# EAGLE schematic 75 (EAGLE 9.6.1)
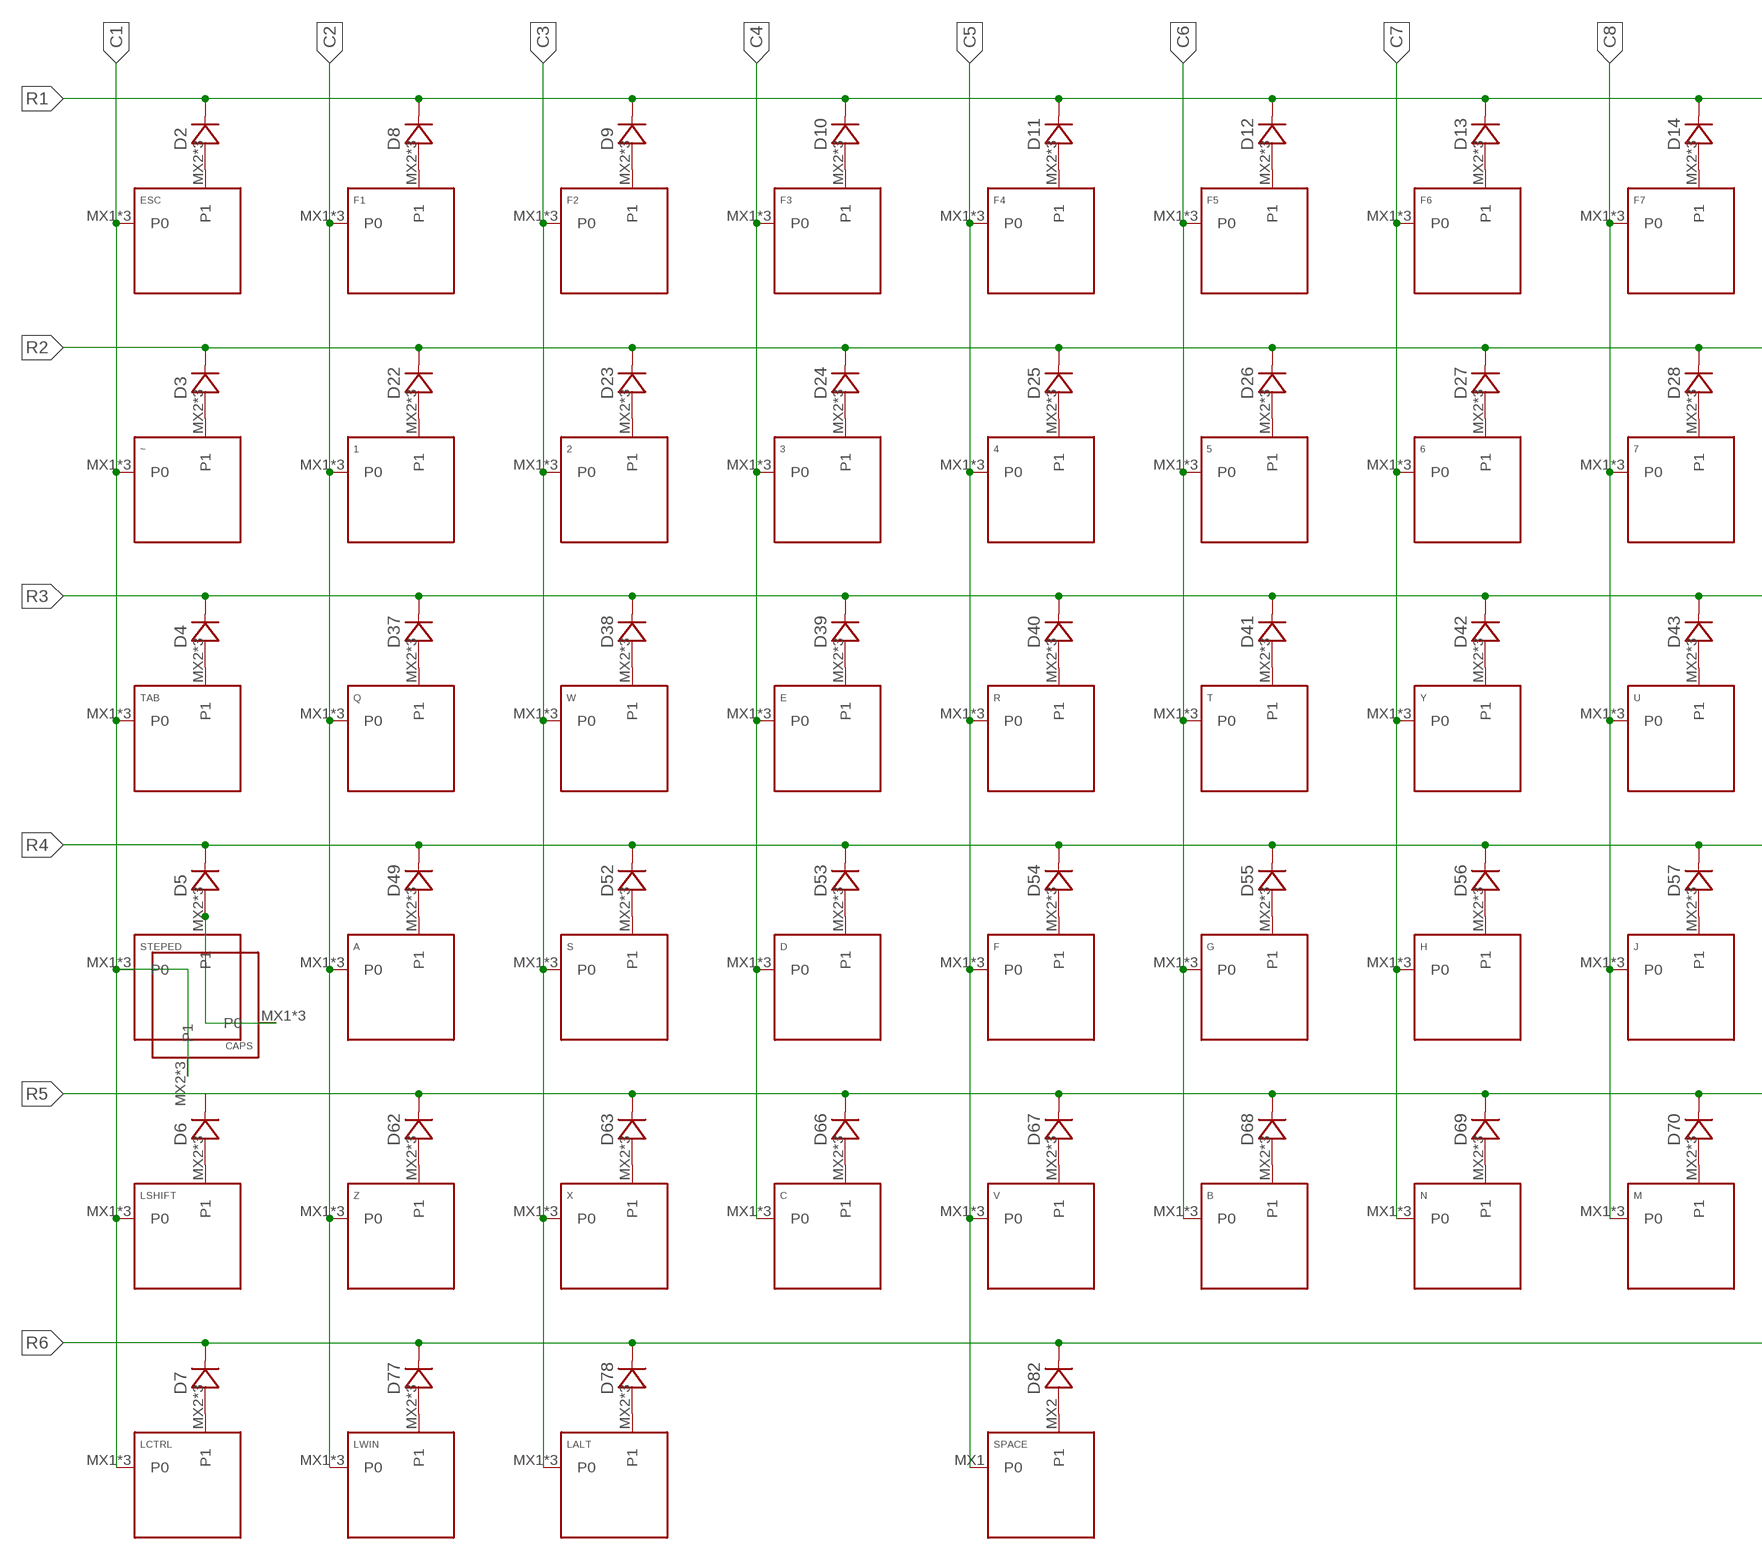
[diagram p0: schematic, sheet 1, part 1 of 2]
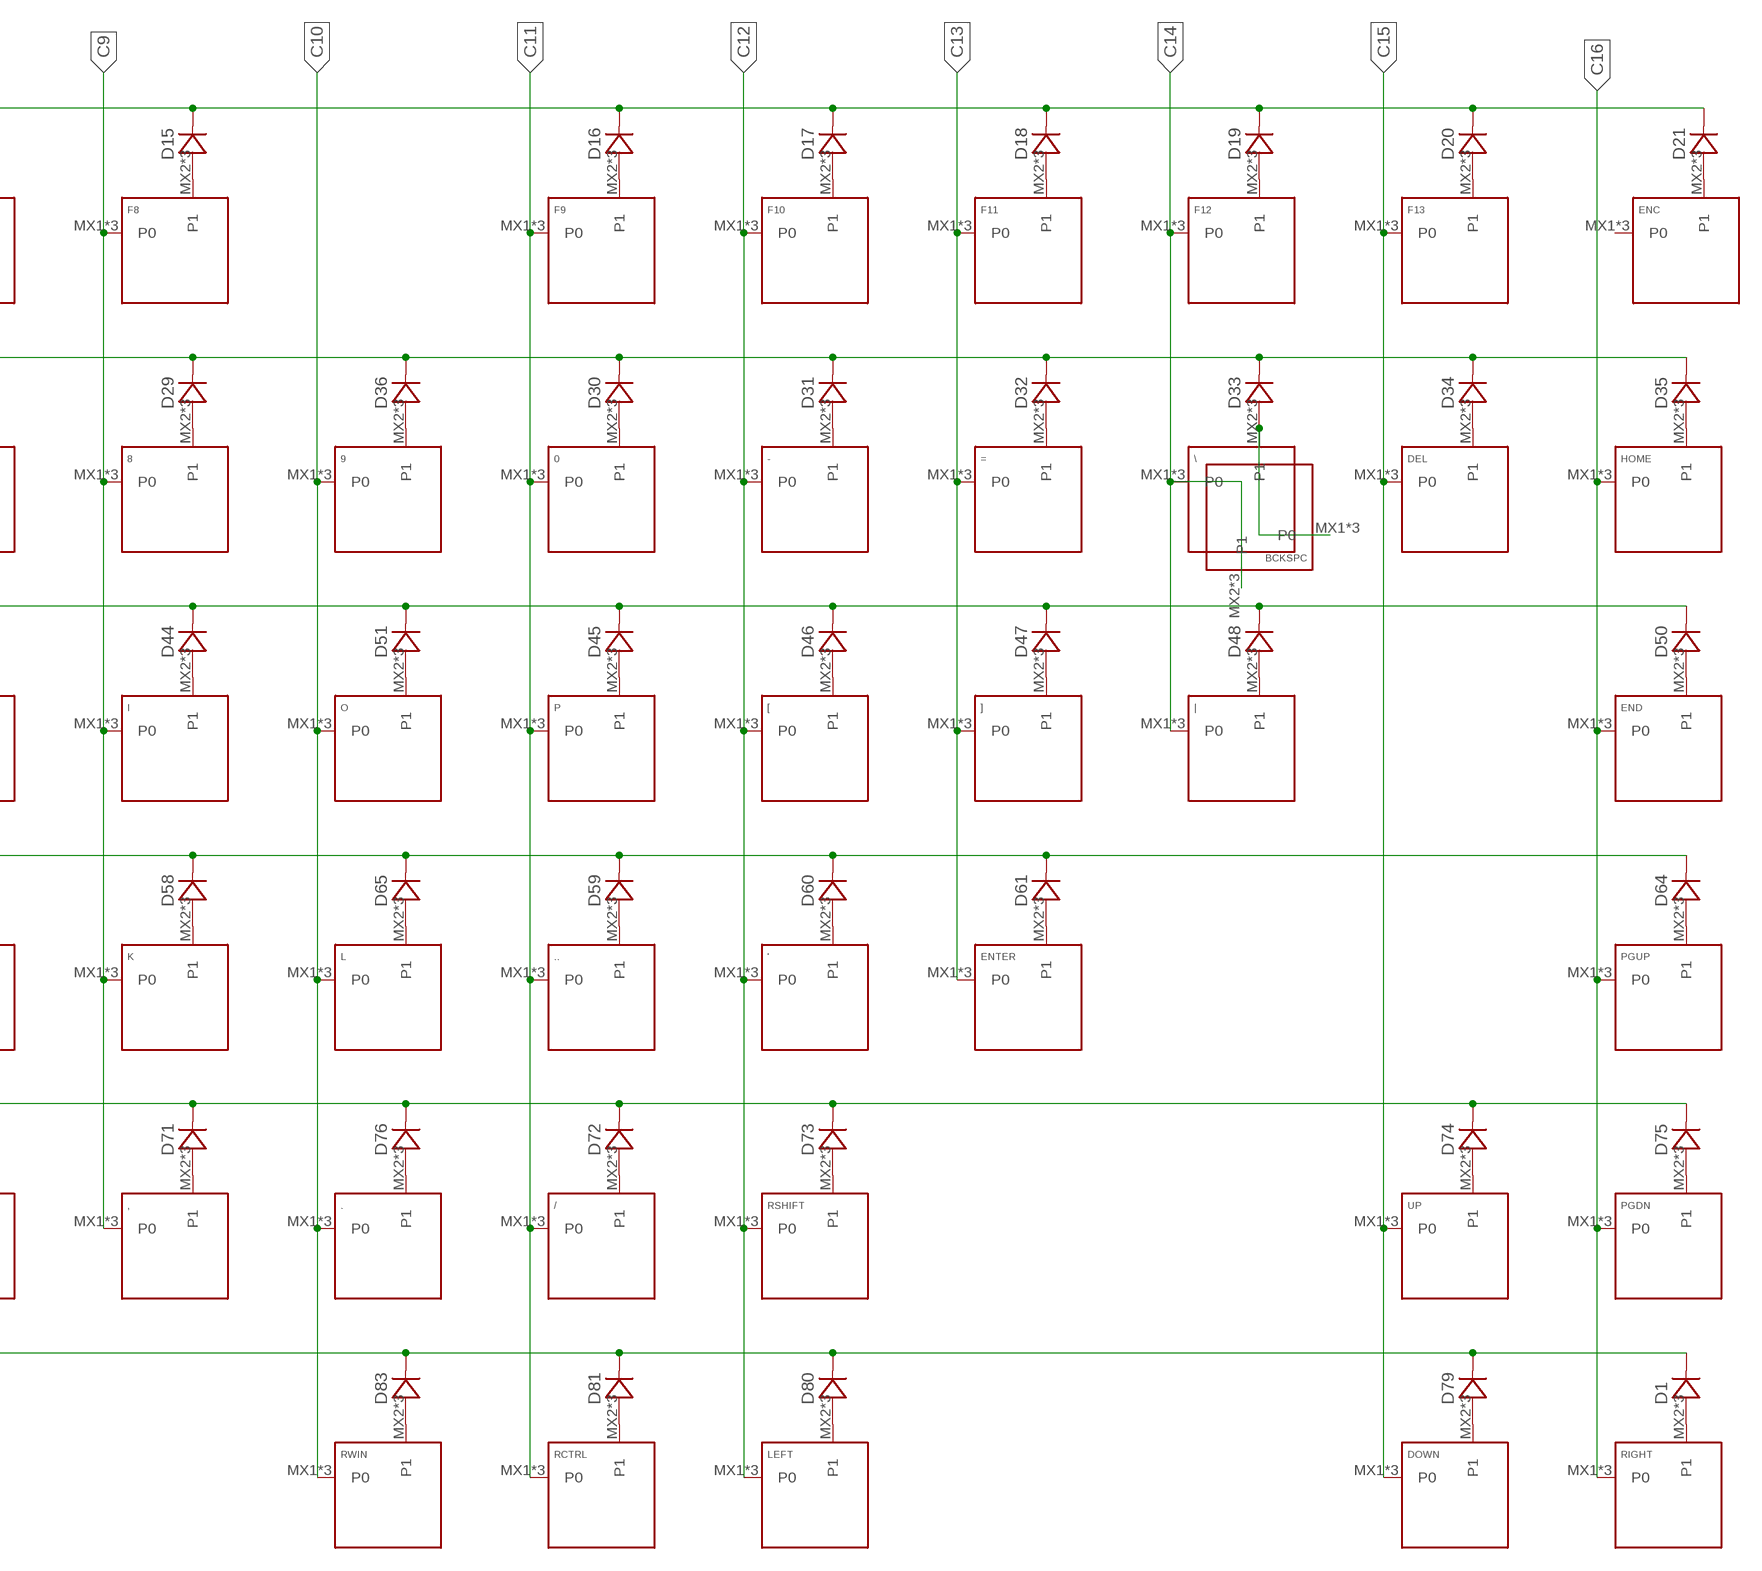
[diagram p1: schematic, sheet 1, part 2 of 2]

## Parts
0  KEYSWITCH-PLAIN-MXHSPCB-1U  [MXHSPCB-1U]
1  KEYSWITCH-PLAIN-MXHSPCB-1U  [MXHSPCB-1U]
2  KEYSWITCH-PLAIN-MXHSPCB-1U  [MXHSPCB-1U]
3  KEYSWITCH-PLAIN-MXHSPCB-1U  [MXHSPCB-1U]
4  KEYSWITCH-PLAIN-MXHSPCB-1U  [MXHSPCB-1U]
5  KEYSWITCH-PLAIN-MXHSPCB-1U  [MXHSPCB-1U]
6  KEYSWITCH-PLAIN-MXHSPCB-1U  [MXHSPCB-1U]
7  KEYSWITCH-PLAIN-MXHSPCB-1U  [MXHSPCB-1U]
8  KEYSWITCH-PLAIN-MXHSPCB-1U  [MXHSPCB-1U]
9  KEYSWITCH-PLAIN-MXHSPCB-1U  [MXHSPCB-1U]
'  KEYSWITCH-PLAIN-MXHSPCB-1U  [MXHSPCB-1U]
,  KEYSWITCH-PLAIN-MXHSPCB-1U  [MXHSPCB-1U]
-  KEYSWITCH-PLAIN-MXHSPCB-1U  [MXHSPCB-1U]
.  KEYSWITCH-PLAIN-MXHSPCB-1U  [MXHSPCB-1U]
..  KEYSWITCH-PLAIN-MXHSPCB-1U  [MXHSPCB-1U]
/  KEYSWITCH-PLAIN-MXHSPCB-1U  [MXHSPCB-1U]
=  KEYSWITCH-PLAIN-MXHSPCB-1U  [MXHSPCB-1U]
[  KEYSWITCH-PLAIN-MXHSPCB-1U  [MXHSPCB-1U]
\\  KEYSWITCH-PLAIN-MXHSPCB-1U  [MXHSPCB-1U]
]  KEYSWITCH-PLAIN-MXHSPCB-1U  [MXHSPCB-1U]
A  KEYSWITCH-PLAIN-MXHSPCB-1U  [MXHSPCB-1U]
B  KEYSWITCH-PLAIN-MXHSPCB-1U  [MXHSPCB-1U]
BCKSPC  KEYSWITCH-PLAIN-MXHSPCB-2U  [MXHSPCB-2U]
C  KEYSWITCH-PLAIN-MXHSPCB-1U  [MXHSPCB-1U]
CAPS  KEYSWITCH-PLAIN-MXHSPCB-1U  [MXHSPCB-1U]
D  KEYSWITCH-PLAIN-MXHSPCB-1U  [MXHSPCB-1U]
D1  DIODE-SOD-123  [SOD-123]
D2  DIODE-SOD-123  [SOD-123]
D3  DIODE-SOD-123  [SOD-123]
D4  DIODE-SOD-123  [SOD-123]
D5  DIODE-SOD-123  [SOD-123]
D6  DIODE-SOD-123  [SOD-123]
D7  DIODE-SOD-123  [SOD-123]
D8  DIODE-SOD-123  [SOD-123]
D9  DIODE-SOD-123  [SOD-123]
D10  DIODE-SOD-123  [SOD-123]
D11  DIODE-SOD-123  [SOD-123]
D12  DIODE-SOD-123  [SOD-123]
D13  DIODE-SOD-123  [SOD-123]
D14  DIODE-SOD-123  [SOD-123]
D15  DIODE-SOD-123  [SOD-123]
D16  DIODE-SOD-123  [SOD-123]
D17  DIODE-SOD-123  [SOD-123]
D18  DIODE-SOD-123  [SOD-123]
D19  DIODE-SOD-123  [SOD-123]
D20  DIODE-SOD-123  [SOD-123]
D21  DIODE-SOD-123  [SOD-123]
D22  DIODE-SOD-123  [SOD-123]
D23  DIODE-SOD-123  [SOD-123]
D24  DIODE-SOD-123  [SOD-123]
D25  DIODE-SOD-123  [SOD-123]
D26  DIODE-SOD-123  [SOD-123]
D27  DIODE-SOD-123  [SOD-123]
D28  DIODE-SOD-123  [SOD-123]
D29  DIODE-SOD-123  [SOD-123]
D30  DIODE-SOD-123  [SOD-123]
D31  DIODE-SOD-123  [SOD-123]
D32  DIODE-SOD-123  [SOD-123]
D33  DIODE-SOD-123  [SOD-123]
D34  DIODE-SOD-123  [SOD-123]
D35  DIODE-SOD-123  [SOD-123]
D36  DIODE-SOD-123  [SOD-123]
D37  DIODE-SOD-123  [SOD-123]
D38  DIODE-SOD-123  [SOD-123]
D39  DIODE-SOD-123  [SOD-123]
D40  DIODE-SOD-123  [SOD-123]
D41  DIODE-SOD-123  [SOD-123]
D42  DIODE-SOD-123  [SOD-123]
D43  DIODE-SOD-123  [SOD-123]
D44  DIODE-SOD-123  [SOD-123]
D45  DIODE-SOD-123  [SOD-123]
D46  DIODE-SOD-123  [SOD-123]
D47  DIODE-SOD-123  [SOD-123]
D48  DIODE-SOD-123  [SOD-123]
D49  DIODE-SOD-123  [SOD-123]
D50  DIODE-SOD-123  [SOD-123]
D51  DIODE-SOD-123  [SOD-123]
D52  DIODE-SOD-123  [SOD-123]
D53  DIODE-SOD-123  [SOD-123]
D54  DIODE-SOD-123  [SOD-123]
D55  DIODE-SOD-123  [SOD-123]
D56  DIODE-SOD-123  [SOD-123]
D57  DIODE-SOD-123  [SOD-123]
D58  DIODE-SOD-123  [SOD-123]
D59  DIODE-SOD-123  [SOD-123]
D60  DIODE-SOD-123  [SOD-123]
D61  DIODE-SOD-123  [SOD-123]
D62  DIODE-SOD-123  [SOD-123]
D63  DIODE-SOD-123  [SOD-123]
D64  DIODE-SOD-123  [SOD-123]
D65  DIODE-SOD-123  [SOD-123]
D66  DIODE-SOD-123  [SOD-123]
D67  DIODE-SOD-123  [SOD-123]
D68  DIODE-SOD-123  [SOD-123]
D69  DIODE-SOD-123  [SOD-123]
D70  DIODE-SOD-123  [SOD-123]
D71  DIODE-SOD-123  [SOD-123]
D72  DIODE-SOD-123  [SOD-123]
D73  DIODE-SOD-123  [SOD-123]
D74  DIODE-SOD-123  [SOD-123]
D75  DIODE-SOD-123  [SOD-123]
D76  DIODE-SOD-123  [SOD-123]
D77  DIODE-SOD-123  [SOD-123]
D78  DIODE-SOD-123  [SOD-123]
D79  DIODE-SOD-123  [SOD-123]
D80  DIODE-SOD-123  [SOD-123]
D81  DIODE-SOD-123  [SOD-123]
D82  DIODE-SOD-123  [SOD-123]
D83  DIODE-SOD-123  [SOD-123]
DEL  KEYSWITCH-PLAIN-MXHSPCB-1U  [MXHSPCB-1U]
DOWN  KEYSWITCH-PLAIN-MXHSPCB-1U  [MXHSPCB-1U]
E  KEYSWITCH-PLAIN-MXHSPCB-1U  [MXHSPCB-1U]
ENC  KEYSWITCH-PLAIN-MXHSPCB-1U  [MXHSPCB-1U]
END  KEYSWITCH-PLAIN-MXHSPCB-1U  [MXHSPCB-1U]
ENTER  KEYSWITCH-PLAIN-MXHSPCB-2U-FLIPPED  [MXHSPCB-2U-FLIPPED]
ESC  KEYSWITCH-PLAIN-MXHSPCB-1U  [MXHSPCB-1U]
F  KEYSWITCH-PLAIN-MXHSPCB-1U  [MXHSPCB-1U]
F1  KEYSWITCH-PLAIN-MXHSPCB-1U  [MXHSPCB-1U]
F2  KEYSWITCH-PLAIN-MXHSPCB-1U  [MXHSPCB-1U]
F3  KEYSWITCH-PLAIN-MXHSPCB-1U  [MXHSPCB-1U]
F4  KEYSWITCH-PLAIN-MXHSPCB-1U  [MXHSPCB-1U]
F5  KEYSWITCH-PLAIN-MXHSPCB-1U  [MXHSPCB-1U]
F6  KEYSWITCH-PLAIN-MXHSPCB-1U  [MXHSPCB-1U]
F7  KEYSWITCH-PLAIN-MXHSPCB-1U  [MXHSPCB-1U]
F8  KEYSWITCH-PLAIN-MXHSPCB-1U  [MXHSPCB-1U]
F9  KEYSWITCH-PLAIN-MXHSPCB-1U  [MXHSPCB-1U]
F10  KEYSWITCH-PLAIN-MXHSPCB-1U  [MXHSPCB-1U]
F11  KEYSWITCH-PLAIN-MXHSPCB-1U  [MXHSPCB-1U]
F12  KEYSWITCH-PLAIN-MXHSPCB-1U  [MXHSPCB-1U]
F13  KEYSWITCH-PLAIN-MXHSPCB-1U  [MXHSPCB-1U]
G  KEYSWITCH-PLAIN-MXHSPCB-1U  [MXHSPCB-1U]
H  KEYSWITCH-PLAIN-MXHSPCB-1U  [MXHSPCB-1U]
HOME  KEYSWITCH-PLAIN-MXHSPCB-1U  [MXHSPCB-1U]
I  KEYSWITCH-PLAIN-MXHSPCB-1U  [MXHSPCB-1U]
J  KEYSWITCH-PLAIN-MXHSPCB-1U  [MXHSPCB-1U]
K  KEYSWITCH-PLAIN-MXHSPCB-1U  [MXHSPCB-1U]
L  KEYSWITCH-PLAIN-MXHSPCB-1U  [MXHSPCB-1U]
LALT  KEYSWITCH-PLAIN-MXHSPCB-1U  [MXHSPCB-1U]
LCTRL  KEYSWITCH-PLAIN-MXHSPCB-1U  [MXHSPCB-1U]
LEFT  KEYSWITCH-PLAIN-MXHSPCB-1U  [MXHSPCB-1U]
LSHIFT  KEYSWITCH-PLAIN-MXHS-2U  [MXHS-2U]
LWIN  KEYSWITCH-PLAIN-MXHSPCB-1U  [MXHSPCB-1U]
M  KEYSWITCH-PLAIN-MXHSPCB-1U  [MXHSPCB-1U]
N  KEYSWITCH-PLAIN-MXHSPCB-1U  [MXHSPCB-1U]
O  KEYSWITCH-PLAIN-MXHSPCB-1U  [MXHSPCB-1U]
P  KEYSWITCH-PLAIN-MXHSPCB-1U  [MXHSPCB-1U]
PGDN  KEYSWITCH-PLAIN-MXHSPCB-1U  [MXHSPCB-1U]
PGUP  KEYSWITCH-PLAIN-MXHSPCB-1U  [MXHSPCB-1U]
Q  KEYSWITCH-PLAIN-MXHSPCB-1U  [MXHSPCB-1U]
R  KEYSWITCH-PLAIN-MXHSPCB-1U  [MXHSPCB-1U]
RCTRL  KEYSWITCH-PLAIN-MXHSPCB-1U  [MXHSPCB-1U]
RIGHT  KEYSWITCH-PLAIN-MXHSPCB-1U  [MXHSPCB-1U]
RSHIFT  KEYSWITCH-PLAIN-MXHSPCB-1U  [MXHSPCB-1U]
RWIN  KEYSWITCH-PLAIN-MXHSPCB-1U  [MXHSPCB-1U]
S  KEYSWITCH-PLAIN-MXHSPCB-1U  [MXHSPCB-1U]
SPACE  KEYSWITCH-PLAIN-MXHSPCB-6.25U-FLIPPED  [MXHSPCB-6.25U-FLIPPED]
STEPED  KEYSWITCH-PLAIN-MXHSPCB-1U  [MXHSPCB-1U]
T  KEYSWITCH-PLAIN-MXHSPCB-1U  [MXHSPCB-1U]
TAB  KEYSWITCH-PLAIN-MXHSPCB-1U  [MXHSPCB-1U]
U  KEYSWITCH-PLAIN-MXHSPCB-1U  [MXHSPCB-1U]
UP  KEYSWITCH-PLAIN-MXHSPCB-1U  [MXHSPCB-1U]
V  KEYSWITCH-PLAIN-MXHSPCB-1U  [MXHSPCB-1U]
W  KEYSWITCH-PLAIN-MXHSPCB-1U  [MXHSPCB-1U]
X  KEYSWITCH-PLAIN-MXHSPCB-1U  [MXHSPCB-1U]
Y  KEYSWITCH-PLAIN-MXHSPCB-1U  [MXHSPCB-1U]
Z  KEYSWITCH-PLAIN-MXHSPCB-1U  [MXHSPCB-1U]
|  KEYSWITCH-PLAIN-MXHSPCB-1U  [MXHSPCB-1U]
~  KEYSWITCH-PLAIN-MXHSPCB-1U  [MXHSPCB-1U]

## Nets
C1: CAPS.MX2(P1) CAPS.P$3(P1) CAPS.P$4(P1) ESC.MX1(P0) ESC.P$1(P0) ESC.P$2(P0) LCTRL.MX1(P0) LCTRL.P$1(P0) LCTRL.P$2(P0) LSHIFT.MX1(P0) LSHIFT.P$3(P0) LSHIFT.P$4(P0) STEPED.MX1(P0) STEPED.P$1(P0) STEPED.P$2(P0) TAB.MX1(P0) TAB.P$1(P0) TAB.P$2(P0) ~.MX1(P0) ~.P$1(P0) ~.P$2(P0)
C2: 1.MX1(P0) 1.P$1(P0) 1.P$2(P0) A.MX1(P0) A.P$1(P0) A.P$2(P0) F1.MX1(P0) F1.P$1(P0) F1.P$2(P0) LWIN.MX1(P0) LWIN.P$1(P0) LWIN.P$2(P0) Q.MX1(P0) Q.P$1(P0) Q.P$2(P0) Z.MX1(P0) Z.P$1(P0) Z.P$2(P0)
C3: 2.MX1(P0) 2.P$1(P0) 2.P$2(P0) F2.MX1(P0) F2.P$1(P0) F2.P$2(P0) LALT.MX1(P0) LALT.P$1(P0) LALT.P$2(P0) S.MX1(P0) S.P$1(P0) S.P$2(P0) W.MX1(P0) W.P$1(P0) W.P$2(P0) X.MX1(P0) X.P$1(P0) X.P$2(P0)
C4: 3.MX1(P0) 3.P$1(P0) 3.P$2(P0) C.MX1(P0) C.P$1(P0) C.P$2(P0) D.MX1(P0) D.P$1(P0) D.P$2(P0) E.MX1(P0) E.P$1(P0) E.P$2(P0) F3.MX1(P0) F3.P$1(P0) F3.P$2(P0)
C5: 4.MX1(P0) 4.P$1(P0) 4.P$2(P0) F4.MX1(P0) F4.P$1(P0) F4.P$2(P0) F.MX1(P0) F.P$1(P0) F.P$2(P0) R.MX1(P0) R.P$1(P0) R.P$2(P0) SPACE.MX1(P0) V.MX1(P0) V.P$1(P0) V.P$2(P0)
C6: 5.MX1(P0) 5.P$1(P0) 5.P$2(P0) B.MX1(P0) B.P$1(P0) B.P$2(P0) F5.MX1(P0) F5.P$1(P0) F5.P$2(P0) G.MX1(P0) G.P$1(P0) G.P$2(P0) T.MX1(P0) T.P$1(P0) T.P$2(P0)
C7: 6.MX1(P0) 6.P$1(P0) 6.P$2(P0) F6.MX1(P0) F6.P$1(P0) F6.P$2(P0) H.MX1(P0) H.P$1(P0) H.P$2(P0) N.MX1(P0) N.P$1(P0) N.P$2(P0) Y.MX1(P0) Y.P$1(P0) Y.P$2(P0)
C8: 7.MX1(P0) 7.P$1(P0) 7.P$2(P0) F7.MX1(P0) F7.P$1(P0) F7.P$2(P0) J.MX1(P0) J.P$1(P0) J.P$2(P0) M.MX1(P0) M.P$1(P0) M.P$2(P0) U.MX1(P0) U.P$1(P0) U.P$2(P0)
C9: 8.MX1(P0) 8.P$1(P0) 8.P$2(P0) ,.MX1(P0) ,.P$1(P0) ,.P$2(P0) F8.MX1(P0) F8.P$1(P0) F8.P$2(P0) I.MX1(P0) I.P$1(P0) I.P$2(P0) K.MX1(P0) K.P$1(P0) K.P$2(P0)
C10: 9.MX1(P0) 9.P$1(P0) 9.P$2(P0) ..MX1(P0) ..P$1(P0) ..P$2(P0) L.MX1(P0) L.P$1(P0) L.P$2(P0) O.MX1(P0) O.P$1(P0) O.P$2(P0) RWIN.MX1(P0) RWIN.P$1(P0) RWIN.P$2(P0)
C11: 0.MX1(P0) 0.P$1(P0) 0.P$2(P0) ...MX1(P0) ...P$1(P0) ...P$2(P0) /.MX1(P0) /.P$1(P0) /.P$2(P0) F9.MX1(P0) F9.P$1(P0) F9.P$2(P0) P.MX1(P0) P.P$1(P0) P.P$2(P0) RCTRL.MX1(P0) RCTRL.P$1(P0) RCTRL.P$2(P0)
C12: '.MX1(P0) '.P$1(P0) '.P$2(P0) -.MX1(P0) -.P$1(P0) -.P$2(P0) [.MX1(P0) [.P$1(P0) [.P$2(P0) F10.MX1(P0) F10.P$1(P0) F10.P$2(P0) LEFT.MX1(P0) LEFT.P$1(P0) LEFT.P$2(P0) RSHIFT.MX1(P0) RSHIFT.P$1(P0) RSHIFT.P$2(P0)
C13: =.MX1(P0) =.P$1(P0) =.P$2(P0) ].MX1(P0) ].P$1(P0) ].P$2(P0) ENTER.MX1(P0) ENTER.P$1(P0) ENTER.P$2(P0) F11.MX1(P0) F11.P$1(P0) F11.P$2(P0)
C14: \\.MX1(P0) \\.P$1(P0) \\.P$2(P0) BCKSPC.MX2(P1) BCKSPC.P$3(P1) BCKSPC.P$4(P1) F12.MX1(P0) F12.P$1(P0) F12.P$2(P0) |.MX1(P0) |.P$1(P0) |.P$2(P0)
C15: DEL.MX1(P0) DEL.P$1(P0) DEL.P$2(P0) DOWN.MX1(P0) DOWN.P$1(P0) DOWN.P$2(P0) F13.MX1(P0) F13.P$1(P0) F13.P$2(P0) UP.MX1(P0) UP.P$1(P0) UP.P$2(P0)
C16: END.MX1(P0) END.P$1(P0) END.P$2(P0) HOME.MX1(P0) HOME.P$1(P0) HOME.P$2(P0) PGDN.MX1(P0) PGDN.P$1(P0) PGDN.P$2(P0) PGUP.MX1(P0) PGUP.P$1(P0) PGUP.P$2(P0) RIGHT.MX1(P0) RIGHT.P$1(P0) RIGHT.P$2(P0)
N$1: D2.A ESC.MX2(P1) ESC.P$3(P1) ESC.P$4(P1)
N$2: D3.A ~.MX2(P1) ~.P$3(P1) ~.P$4(P1)
N$3: D4.A TAB.MX2(P1) TAB.P$3(P1) TAB.P$4(P1)
N$4: CAPS.MX1(P0) CAPS.P$1(P0) CAPS.P$2(P0) D5.A STEPED.MX2(P1) STEPED.P$3(P1) STEPED.P$4(P1)
N$5: D6.A LSHIFT.MX2(P1) LSHIFT.P$1(P1) LSHIFT.P$2(P1)
N$6: D7.A LCTRL.MX2(P1) LCTRL.P$3(P1) LCTRL.P$4(P1)
N$7: D81.A RCTRL.MX2(P1) RCTRL.P$3(P1) RCTRL.P$4(P1)
N$8: D8.A F1.MX2(P1) F1.P$3(P1) F1.P$4(P1)
N$9: D9.A F2.MX2(P1) F2.P$3(P1) F2.P$4(P1)
N$10: D10.A F3.MX2(P1) F3.P$3(P1) F3.P$4(P1)
N$11: D11.A F4.MX2(P1) F4.P$3(P1) F4.P$4(P1)
N$12: D12.A F5.MX2(P1) F5.P$3(P1) F5.P$4(P1)
N$13: D13.A F6.MX2(P1) F6.P$3(P1) F6.P$4(P1)
N$14: D14.A F7.MX2(P1) F7.P$3(P1) F7.P$4(P1)
N$15: D15.A F8.MX2(P1) F8.P$3(P1) F8.P$4(P1)
N$16: D16.A F9.MX2(P1) F9.P$3(P1) F9.P$4(P1)
N$17: D17.A F10.MX2(P1) F10.P$3(P1) F10.P$4(P1)
N$18: D18.A F11.MX2(P1) F11.P$3(P1) F11.P$4(P1)
N$19: D19.A F12.MX2(P1) F12.P$3(P1) F12.P$4(P1)
N$20: D20.A F13.MX2(P1) F13.P$3(P1) F13.P$4(P1)
N$24: 1.MX2(P1) 1.P$3(P1) 1.P$4(P1) D22.A
N$25: 2.MX2(P1) 2.P$3(P1) 2.P$4(P1) D23.A
N$26: 3.MX2(P1) 3.P$3(P1) 3.P$4(P1) D24.A
N$27: 4.MX2(P1) 4.P$3(P1) 4.P$4(P1) D25.A
N$28: 5.MX2(P1) 5.P$3(P1) 5.P$4(P1) D26.A
N$29: 6.MX2(P1) 6.P$3(P1) 6.P$4(P1) D27.A
N$30: 7.MX2(P1) 7.P$3(P1) 7.P$4(P1) D28.A
N$31: 8.MX2(P1) 8.P$3(P1) 8.P$4(P1) D29.A
N$32: 0.MX2(P1) 0.P$3(P1) 0.P$4(P1) D30.A
N$33: -.MX2(P1) -.P$3(P1) -.P$4(P1) D31.A
N$34: =.MX2(P1) =.P$3(P1) =.P$4(P1) D32.A
N$35: \\.MX2(P1) \\.P$3(P1) \\.P$4(P1) BCKSPC.MX1(P0) BCKSPC.P$1(P0) BCKSPC.P$2(P0) D33.A
N$36: D34.A DEL.MX2(P1) DEL.P$3(P1) DEL.P$4(P1)
N$37: D35.A HOME.MX2(P1) HOME.P$3(P1) HOME.P$4(P1)
N$38: 9.MX2(P1) 9.P$3(P1) 9.P$4(P1) D36.A
N$39: D37.A Q.MX2(P1) Q.P$3(P1) Q.P$4(P1)
N$40: D38.A W.MX2(P1) W.P$3(P1) W.P$4(P1)
N$41: D39.A E.MX2(P1) E.P$3(P1) E.P$4(P1)
N$42: D40.A R.MX2(P1) R.P$3(P1) R.P$4(P1)
N$43: D41.A T.MX2(P1) T.P$3(P1) T.P$4(P1)
N$44: D42.A Y.MX2(P1) Y.P$3(P1) Y.P$4(P1)
N$45: D43.A U.MX2(P1) U.P$3(P1) U.P$4(P1)
N$46: D21.A ENC.MX2(P1) ENC.P$3(P1) ENC.P$4(P1)
N$54: D44.A I.MX2(P1) I.P$3(P1) I.P$4(P1)
N$55: D51.A O.MX2(P1) O.P$3(P1) O.P$4(P1)
N$56: D45.A P.MX2(P1) P.P$3(P1) P.P$4(P1)
N$57: [.MX2(P1) [.P$3(P1) [.P$4(P1) D46.A
N$58: ].MX2(P1) ].P$3(P1) ].P$4(P1) D47.A
N$60: D48.A |.MX2(P1) |.P$3(P1) |.P$4(P1)
N$61: D50.A END.MX2(P1) END.P$3(P1) END.P$4(P1)
N$62: A.MX2(P1) A.P$3(P1) A.P$4(P1) D49.A
N$63: D52.A S.MX2(P1) S.P$3(P1) S.P$4(P1)
N$64: D53.A D.MX2(P1) D.P$3(P1) D.P$4(P1)
N$65: D54.A F.MX2(P1) F.P$3(P1) F.P$4(P1)
N$66: D55.A G.MX2(P1) G.P$3(P1) G.P$4(P1)
N$69: D56.A H.MX2(P1) H.P$3(P1) H.P$4(P1)
N$70: D57.A J.MX2(P1) J.P$3(P1) J.P$4(P1)
N$71: D58.A K.MX2(P1) K.P$3(P1) K.P$4(P1)
N$72: D65.A L.MX2(P1) L.P$3(P1) L.P$4(P1)
N$73: ...MX2(P1) ...P$3(P1) ...P$4(P1) D59.A
N$77: '.MX2(P1) '.P$3(P1) '.P$4(P1) D60.A
N$78: D61.A ENTER.MX2(P1) ENTER.P$3(P1) ENTER.P$4(P1)
N$81: D64.A PGUP.MX2(P1) PGUP.P$3(P1) PGUP.P$4(P1)
N$87: D62.A Z.MX2(P1) Z.P$3(P1) Z.P$4(P1)
N$88: D63.A X.MX2(P1) X.P$3(P1) X.P$4(P1)
N$89: C.MX2(P1) C.P$3(P1) C.P$4(P1) D66.A
N$90: D67.A V.MX2(P1) V.P$3(P1) V.P$4(P1)
N$91: B.MX2(P1) B.P$3(P1) B.P$4(P1) D68.A
N$92: D69.A N.MX2(P1) N.P$3(P1) N.P$4(P1)
N$93: D70.A M.MX2(P1) M.P$3(P1) M.P$4(P1)
N$94: ,.MX2(P1) ,.P$3(P1) ,.P$4(P1) D71.A
N$95: ..MX2(P1) ..P$3(P1) ..P$4(P1) D76.A
N$96: /.MX2(P1) /.P$3(P1) /.P$4(P1) D72.A
N$97: D73.A RSHIFT.MX2(P1) RSHIFT.P$3(P1) RSHIFT.P$4(P1)
N$98: D75.A PGDN.MX2(P1) PGDN.P$3(P1) PGDN.P$4(P1)
N$99: D74.A UP.MX2(P1) UP.P$3(P1) UP.P$4(P1)
N$100: D77.A LWIN.MX2(P1) LWIN.P$3(P1) LWIN.P$4(P1)
N$101: D78.A LALT.MX2(P1) LALT.P$3(P1) LALT.P$4(P1)
N$102: D82.A SPACE.MX2(P1)
N$103: D83.A RWIN.MX2(P1) RWIN.P$3(P1) RWIN.P$4(P1)
N$104: D80.A LEFT.MX2(P1) LEFT.P$3(P1) LEFT.P$4(P1)
N$105: D1.A RIGHT.MX2(P1) RIGHT.P$3(P1) RIGHT.P$4(P1)
N$106: D79.A DOWN.MX2(P1) DOWN.P$3(P1) DOWN.P$4(P1)
R1: D2.C D8.C D9.C D10.C D11.C D12.C D13.C D14.C D15.C D16.C D17.C D18.C D19.C D20.C D21.C
R2: D3.C D22.C D23.C D24.C D25.C D26.C D27.C D28.C D29.C D30.C D31.C D32.C D33.C D34.C D35.C D36.C
R3: D4.C D37.C D38.C D39.C D40.C D41.C D42.C D43.C D44.C D45.C D46.C D47.C D48.C D50.C D51.C
R4: D5.C D49.C D52.C D53.C D54.C D55.C D56.C D57.C D58.C D59.C D60.C D61.C D64.C D65.C
R5: D6.C D62.C D63.C D66.C D67.C D68.C D69.C D70.C D71.C D72.C D73.C D74.C D75.C D76.C
R6: D1.C D7.C D77.C D78.C D79.C D80.C D81.C D82.C D83.C
Unconnected: ENC.MX1(P0) ENC.P$1(P0) ENC.P$2(P0)

## Library data of the parts
0 1-9 ' , - . .. / = [ \\ ] A B BCKSPC C CAPS D DEL DOWN E ENC END ENTER ESC F F1-F13 G H HOME I J K L LALT LCTRL LEFT LSHIFT LWIN M N O P PGDN PGUP Q R RCTRL RIGHT RSHIFT RWIN S SPACE STEPED T TAB U UP V W X Y Z | ~ = Keyboard:KEYSWITCH-PLAIN
D1-D83 = Components:DIODE: Standard 1N4148 diode